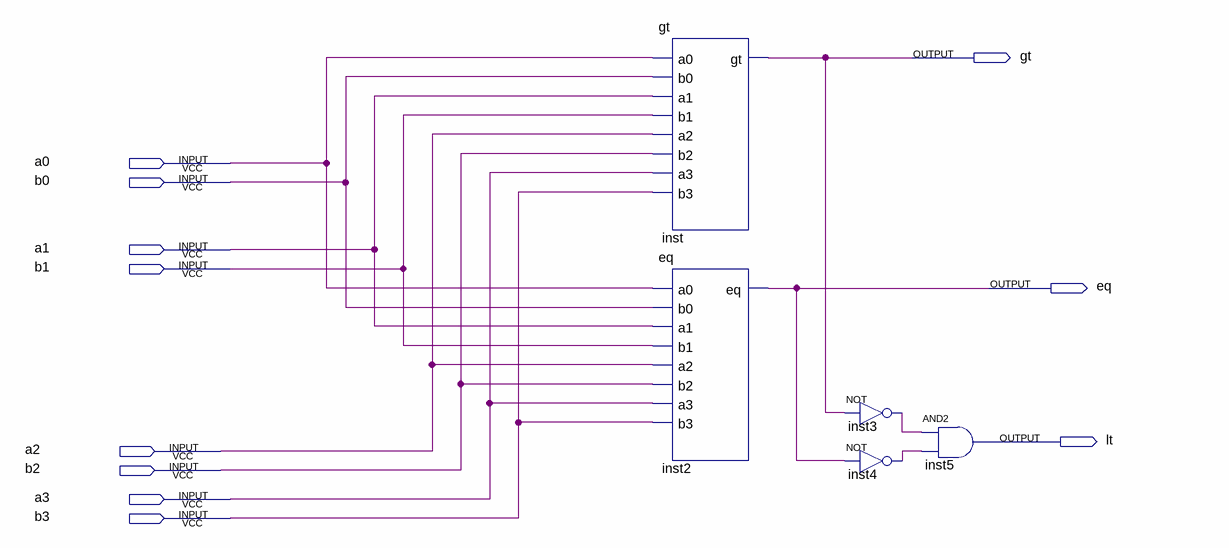
[diagram p0: schematic sheet]
// Quartus schematic comp4.bdf as structural Verilog: 5 symbols, 11 pins
module comp4 (
  input  a0,
  input  b0,
  input  a1,
  input  b1,
  input  a2,
  input  b2,
  input  a3,
  input  b3,
  output gt,
  output eq,
  output lt
);

  wire inst3_out, inst4_out;

  gt inst (.a0(a0), .b0(b0), .a1(a1), .b1(b1), .a2(a2), .b2(b2), .a3(a3), .b3(b3), .gt(gt));
  eq inst2 (.a0(a0), .b0(b0), .a1(a1), .b1(b1), .a2(a2), .b2(b2), .a3(a3), .b3(b3), .eq(eq));
  not inst3 (inst3_out, gt);
  not inst4 (inst4_out, eq);
  and inst5 (lt, inst3_out, inst4_out);
endmodule
